# Altium schematic sheet Sheet2.SchDoc
size A4; SheetNumber: 2; SheetTotal: 2
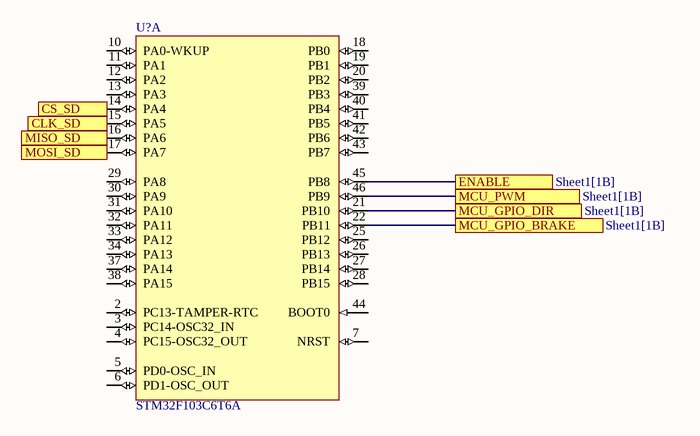
[diagram p0: Sheet2.SchDoc]

## Parts
U?  STM32F103C6T6A  [STM-LQFP48_L]  (part A of 2)

## Ports
CLK_SD, CS_SD, ENABLE (see Sheet1[1B]), MCU_GPIO_BRAKE (see Sheet1[1B]), MCU_GPIO_DIR (see Sheet1[1B]), MCU_PWM (see Sheet1[1B]), MISO_SD, MOSI_SD

## Nets
CLK_SD: U?.15(PA5) ; port CLK_SD
CS_SD: U?.14(PA4) ; port CS_SD
ENABLE: U?.45(PB8) ; port ENABLE
MCU_GPIO_BRAKE: U?.22(PB11) ; port MCU_GPIO_BRAKE
MCU_GPIO_DIR: U?.21(PB10) ; port MCU_GPIO_DIR
MCU_PWM: U?.46(PB9) ; port MCU_PWM
MISO_SD: U?.16(PA6) ; port MISO_SD
MOSI_SD: U?.17(PA7) ; port MOSI_SD

Not connected (* = marked no-connect by the designer): U? 2(PC13-TAMPER-RTC) 3(PC14-OSC32_IN) 4(PC15-OSC32_OUT) 5(PD0-OSC_IN) 6(PD1-OSC_OUT) 7(NRST) 10(PA0-WKUP) 11(PA1) 12(PA2) 13(PA3) 18(PB0) 19(PB1) 20(PB2) 25(PB12) 26(PB13) 27(PB14) 28(PB15) 29(PA8) 30(PA9) 31(PA10) 32(PA11) 33(PA12) 34(PA13) 37(PA14) 38(PA15) 39(PB3) 40(PB4) 41(PB5) 42(PB6) 43(PB7) 44(BOOT0)

## Library data of the parts
U? = CMP-0237-00254-3: ARM Cortex-M3 32-bit MCU, 32 KB Flash, 10 KB Internal RAM, 37 I/Os, 48-pin LQFP, -40 to 85 degC, Tray; Operating Frequency(F) (Processor speed) (MHz): 72; A/D Converter: 2x12-bit (10 Channel); Supply Voltage(Vcc) min (V): 2; FLASH Size (Prog) (kB): 32; I/Os (High Current): 37; Internal RAM Size (kB): 10; PackageVersion: Rev. 6, 06/2013; ComponentLink3Description: Package Specification; ComponentLink2URL: http://www.st.com/st-web-ui/static/active/en/resource/technical/document/datasheet/CD00210843.pdf; ComponentLink1URL: http://www.st.com/web/en/home.html; PackageDescription: 48-Pin Low Profile Quad Flat Package, 7 x 7 mm Body, 0.5 mm Pitch; PartNumber: STM32F103C6T6A; ComponentLink3URL: http://www.st.com/st-web-ui/static/active/en/resource/technical/document/datasheet/DM00058181.pdf; PackageReference: LQFP48; Packing: Tray; ComponentLink2Description: Datasheet; Mounting Technology: Surface Mount; ComponentLink1Description: Manufacturer URL; Core: ARM Cortex-M3; DatasheetVersion: Rev. 6